# Altium schematic sheet main.SchDoc
size A4; SheetNumber: 1; SheetTotal: 4
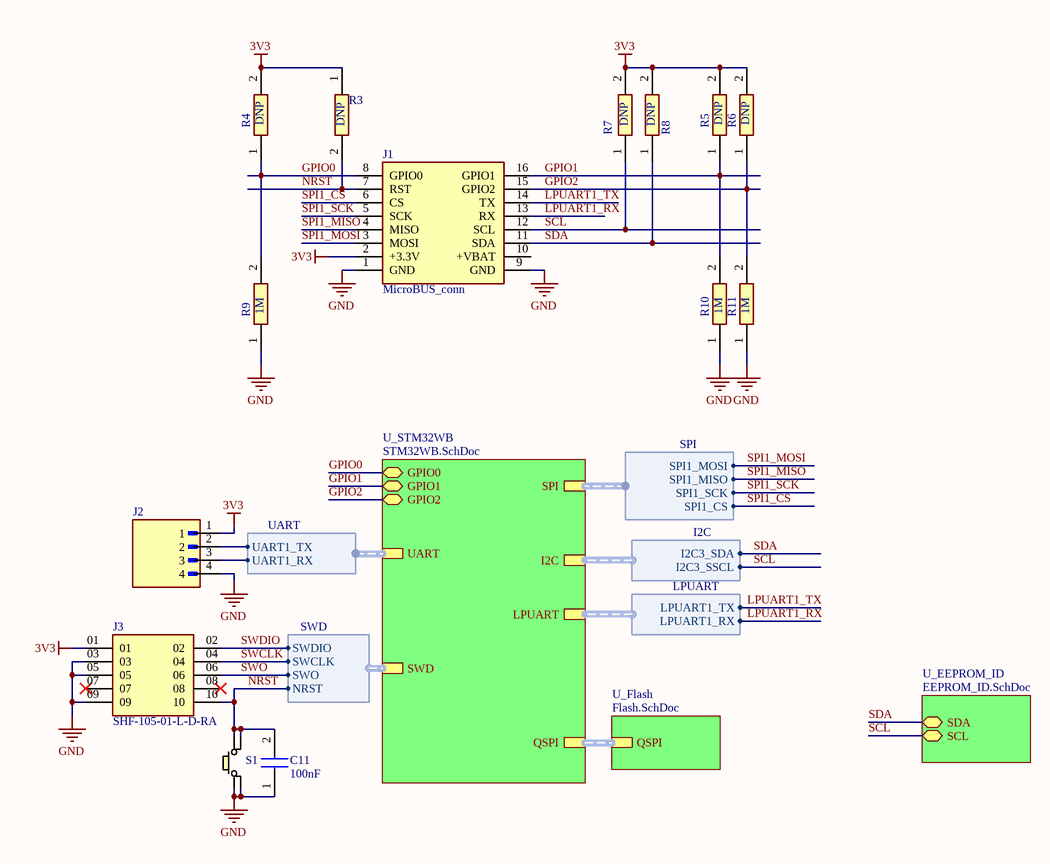
[diagram p0: main.SchDoc]

## Parts
C11  100nF  [CAPC1005X70N]
J1  MicroBUS_conn  [MicroBUS_header]
J2  310-87-104-41-205101  [310-87-104-41-205101]  (value not drawn)
J3  SHF-105-01-L-D-RA  [SAMTEC_SHF-105-01-L-D-RA]
R3  DNP  [RESC1005X35N]
R4  DNP  [RESC1005X40N]
R5  DNP  [RESC1005X40N]
R6  DNP  [RESC1005X40N]
R7  DNP  [RESC1005X35N]
R8  DNP  [RESC1005X35N]
R9  1M  [RESC1005X40N]
R10  1M  [RESC1005X40N]
R11  1M  [RESC1005X40N]
S1  KMR731NG_LFS  [KMR731NGLFS]  (value not drawn)

## Sub-sheets
U_EEPROM_ID = EEPROM_ID.SchDoc: SDA (bidir), SCL (bidir)
U_Flash = Flash.SchDoc: QSPI (harness QSPI)
U_STM32WB = STM32WB.SchDoc: SWD (harness SWD), QSPI (harness QSPI), LPUART (harness LPUART), UART (harness UART), SPI (harness SPI), I2C (harness I2C), GPIO0 (bidir), GPIO1 (bidir), GPIO2 (bidir)

## Harnesses
SPI: SPI1_MOSI, SPI1_MISO, SPI1_SCK, SPI1_CS
UART: UART1_TX, UART1_RX
I2C: I2C3_SDA, I2C3_SSCL
LPUART: LPUART1_TX, LPUART1_RX
SWD: SWDIO, SWCLK, SWO, NRST

## Nets
3V3: J1.2(+3.3V) J2.1 J3.01 R3.1 R4.2 R5.2 R6.2 R7.2 R8.2
GND: C11.1 J1.1(GND) J1.9(GND) J2.4 J3.03 J3.05 J3.09 R9.1 R10.1 R11.1 S1.1 S1.2
GPIO0: J1.8(GPIO0) R4.1 R9.2 ; sheet U_STM32WB/GPIO0
GPIO1: J1.16(GPIO1) R5.1 R10.2 ; sheet U_STM32WB/GPIO1
GPIO2: J1.15(GPIO2) R6.1 R11.2 ; sheet U_STM32WB/GPIO2
LPUART1_RX: J1.13(RX) ; sheet U_STM32WB/LPUART.LPUART1_RX
LPUART1_TX: J1.14(TX) ; sheet U_STM32WB/LPUART.LPUART1_TX
NRST: C11.2 J1.7(RST) J3.10 R3.2 S1.3 S1.4 ; sheet U_STM32WB/SWD.NRST
SCL: J1.12(SCL) R7.1 ; sheet U_EEPROM_ID/SCL, sheet U_STM32WB/I2C.I2C3_SSCL
SDA: J1.11(SDA) R8.1 ; sheet U_EEPROM_ID/SDA, sheet U_STM32WB/I2C.I2C3_SDA
SPI1_CS: J1.6(CS) ; sheet U_STM32WB/SPI.SPI1_CS
SPI1_MISO: J1.4(MISO) ; sheet U_STM32WB/SPI.SPI1_MISO
SPI1_MOSI: J1.3(MOSI) ; sheet U_STM32WB/SPI.SPI1_MOSI
SPI1_SCK: J1.5(SCK) ; sheet U_STM32WB/SPI.SPI1_SCK
SWCLK: J3.04 ; sheet U_STM32WB/SWD.SWCLK
SWDIO: J3.02 ; sheet U_STM32WB/SWD.SWDIO
SWO: J3.06 ; sheet U_STM32WB/SWD.SWO
NetJ2_2: J2.2 ; sheet U_STM32WB/UART.UART1_TX
NetJ2_3: J2.3 ; sheet U_STM32WB/UART.UART1_RX

Not connected (* = marked no-connect by the designer): J1 10(+VBAT); J3 07* 08*

## Buses and harness runs
harness sheet U_Flash/QSPI = sheet U_STM32WB/QSPI

## Notes on the sheet
- Title:
- Date:
- Project:
- Type:
- Schematic
- Variant:
- Revision:
- Sheet
- of
- Author:
- Evžen Šteif
- Size:
- A4

## Library data of the parts
C11 = GRM155R61A104KA01D: Capacitor; Manufacturer_Name: Murata Electronics; Datasheet Link: https://search.murata.co.jp/Ceramy/image/img/A01X/G101/ENG/GRM155R61A104KA01-02A.pdf; Height: 0.7mm; Manufacturer_Part_Number: GRM155R61A104KA01D; Mouser Part Number: 81-GRM155R61A104KA01; Mouser Price/Stock: https://www.mouser.co.uk/ProductDetail/Murata-Electronics/GRM155R61A104KA01D?qs=5bAuhL3RhmNZw0v59AqOJA%3D%3D; Arrow Part Number: GRM155R61A104KA01D; Arrow Price/Stock: https://www.arrow.com/en/products/grm155r61a104ka01d/murata-manufacturing?utm_currency=USD&region=europe
J1 = MicroBUS_conn: Connector; Manufacturer_Name: Harwin; Manufacturer_Part_Number: M20-9730845; Datasheet Link: https://cdn.harwin.com/pdfs/M20-973.pdf; Height: 9.54mm; Mouser Part Number: 855-M20-9730845; Mouser Price/Stock: https://www.mouser.co.uk/ProductDetail/Harwin/M20-9730845?qs=%252Bk6%2F5FB6qrnRfgIEPS4Dkw%3D%3D
J3 = SHF-105-01-L-D-RA: MF: Samtec; Value: *; Package: None; Price: None; MP: SHF-105-01-L-D-RA; Availability: Unavailable
R3 = RT0402FRE07100KL: Resistor; Manufacturer_Name: KEMET; Datasheet Link: https://www.yageo.com/upload/media/product/productsearch/datasheet/rchip/PYu-RT_1-to-0.01_RoHS_L_11.pdf; Height: 0.35mm; Manufacturer_Part_Number: RT0402FRE07100KL; Mouser Part Number: 603-RT0402FRE07100KL; Mouser Price/Stock: https://www.mouser.co.uk/ProductDetail/YAGEO/RT0402FRE07100KL?qs=BXCcY9r%252B08CxTvf5JB1kiw%3D%3D; Arrow Part Number: RT0402FRE07100KL; Arrow Price/Stock: https://www.arrow.com/en/products/rt0402fre07100kl/yageo
R4-R6 R9-R11 = RC0402FR-071ML: Resistor; Manufacturer_Name: YAGEO; Datasheet Link: https://componentsearchengine.com/Datasheets/2/RC0402FR-071ML.pdf; Height: 0.4mm; Manufacturer_Part_Number: RC0402FR-071ML; Mouser Part Number: 603-RC0402FR-071ML; Mouser Price/Stock: https://www.mouser.co.uk/ProductDetail/YAGEO/RC0402FR-071ML?qs=V1yeUXFNrknfoI4987wfBQ%3D%3D; Arrow Part Number: RC0402FR-071ML; Arrow Price/Stock: https://www.arrow.com/en/products/rc0402fr-071ml/yageo?region=nac
R7 R8 = RT0402FRE075K1L: Resistor; Manufacturer_Name: YAGEO; Datasheet Link: https://www.yageo.com/upload/media/product/app/datasheet/rchip/pyu-rt_1-to-0.01_rohs_l.pdf; Height: 0.35mm; Manufacturer_Part_Number: RT0402FRE075K1L; Mouser Part Number: RT0402FRE075K1L; Mouser Price/Stock: https://www.mouser.co.uk/ProductDetail/YAGEO/RT0402FRE07100RL?qs=BXCcY9r%252B08AcvLZjF7vcwQ%3D%3D
S1 = KMR731NG_LFS: Switch; Manufacturer_Name: C & K COMPONENTS; Manufacturer_Part_Number: KMR731NG LFS; Datasheet Link: https://www.ckswitches.com/media/1908/kmr7.pdf; Mouser Part Number: 611-KMR731NGLFS; Mouser Price/Stock: https://www.mouser.com/Search/Refine.aspx?Keyword=611-KMR731NGLFS; Arrow Part Number: KMR731NG LFS; Arrow Price/Stock: https://www.arrow.com/en/products/kmr731nglfs/ck